# Altium project KitKTS.PrjPcb (part 3 of 3)

## Sheet 18-Led7.SchDoc
size A4
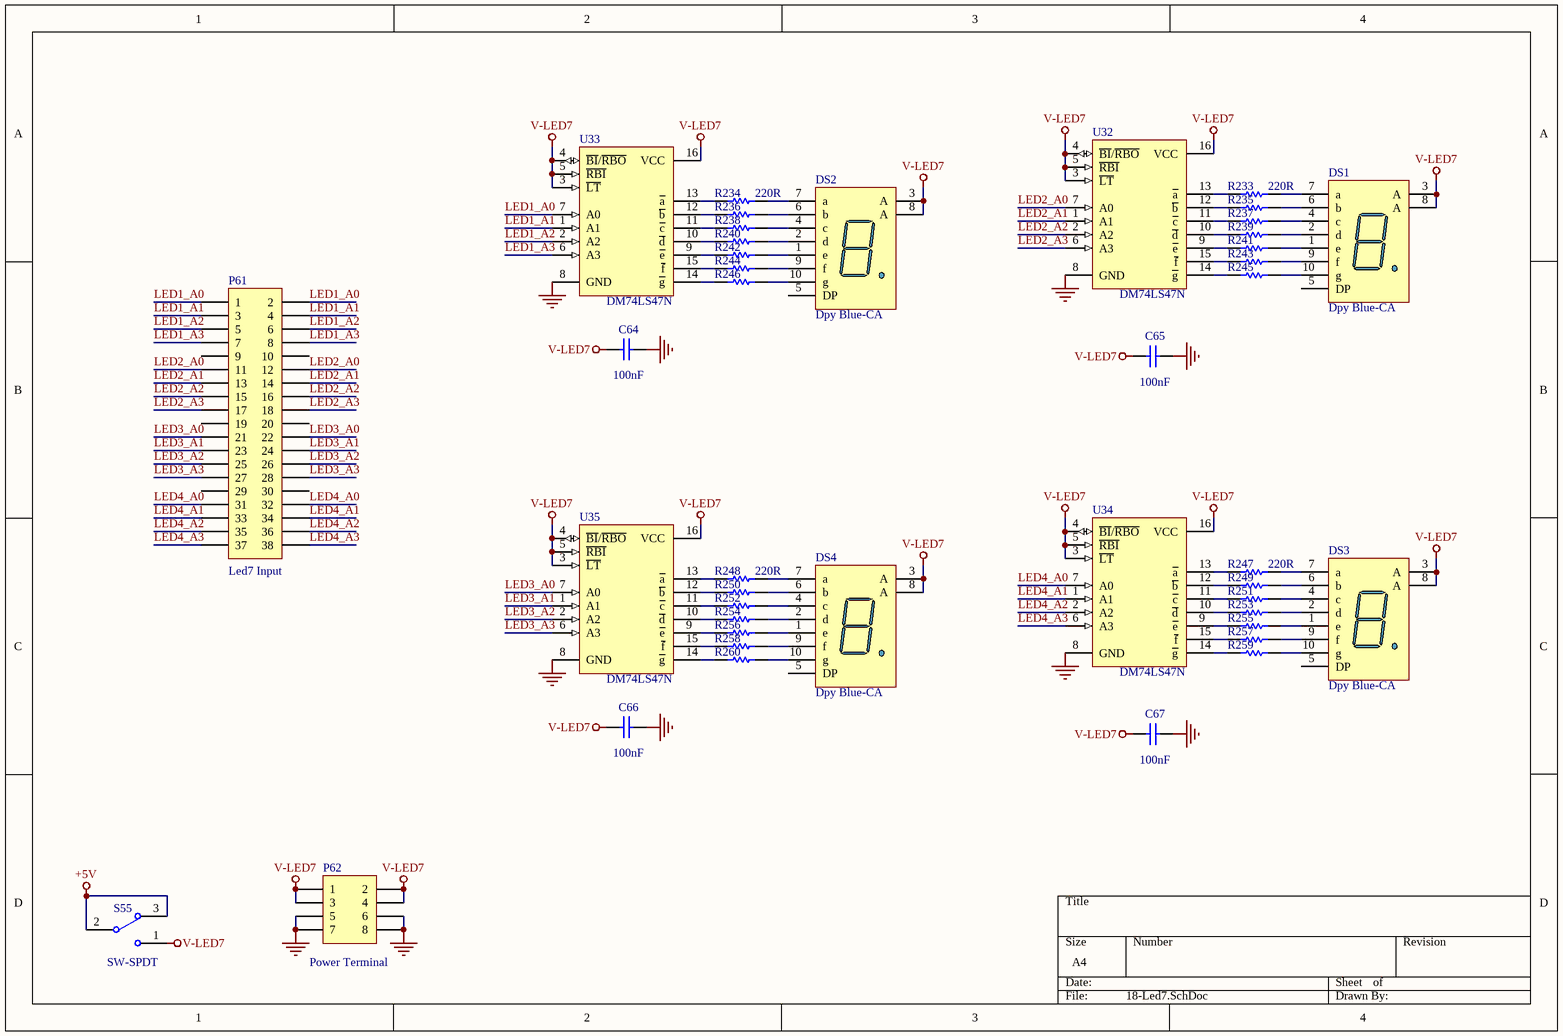
[diagram p25: 18-Led7.SchDoc]

### Parts
C64  value 100nF  [c-0805]  (hidden comment: 104)
C65  value 100nF  [c-0805]  (hidden comment: 104)
C66  value 100nF  [c-0805]  (hidden comment: 104)
C67  value 100nF  [c-0805]  (hidden comment: 104)
DS1  Dpy Blue-CA  [LED7SEG-1-0.56]
DS2  Dpy Blue-CA  [LED7SEG-1-0.56]
DS3  Dpy Blue-CA  [LED7SEG-1-0.56]
DS4  Dpy Blue-CA  [LED7SEG-1-0.56]
P61  value Led7 Input  [HDR2X19]  (hidden comment: Header 19X2)
P62  Publisher: Power Terminal  [HDR2X4]  (hidden comment: Header 4X2)
R233  220R  [r-0805]
R234  220R  [r-0805]
R235  220R  [r-0805]  (value not drawn)
R236  220R  [r-0805]  (value not drawn)
R237  220R  [r-0805]  (value not drawn)
R238  220R  [r-0805]  (value not drawn)
R239  220R  [r-0805]  (value not drawn)
R240  220R  [r-0805]  (value not drawn)
R241  220R  [r-0805]  (value not drawn)
R242  220R  [r-0805]  (value not drawn)
R243  220R  [r-0805]  (value not drawn)
R244  220R  [r-0805]  (value not drawn)
R245  220R  [r-0805]  (value not drawn)
R246  220R  [r-0805]  (value not drawn)
R247  220R  [r-0805]
R248  220R  [r-0805]
R249  220R  [r-0805]  (value not drawn)
R250  220R  [r-0805]  (value not drawn)
R251  220R  [r-0805]  (value not drawn)
R252  220R  [r-0805]  (value not drawn)
R253  220R  [r-0805]  (value not drawn)
R254  220R  [r-0805]  (value not drawn)
R255  220R  [r-0805]  (value not drawn)
R256  220R  [r-0805]  (value not drawn)
R257  220R  [r-0805]  (value not drawn)
R258  220R  [r-0805]  (value not drawn)
R259  220R  [r-0805]  (value not drawn)
R260  220R  [r-0805]  (value not drawn)
S55  SW-SPDT  [sW-DIP1SMD]
U32  DM74LS47N  [DIP16/W0.3]
U33  DM74LS47N  [DIP16/W0.3]
U34  DM74LS47N  [DIP16/W0.3]
U35  DM74LS47N  [DIP16/W0.3]

### Nets
+5V: S55.2 S55.3
GND: C64.2 C65.2 C66.2 C67.2 P62.5 P62.6 P62.7 P62.8 U32.8(GND) U33.8(GND) U34.8(GND) U35.8(GND)
V-LED7: C64.1 C65.1 C66.1 C67.1 DS1.3(A) DS1.8(A) DS2.3(A) DS2.8(A) DS3.3(A) DS3.8(A) DS4.3(A) DS4.8(A) P62.1 P62.2 P62.3 P62.4 S55.1 U32.3(~{LT}) U32.4(~{BI}/~{RBO}) U32.5(~{RBI}) U32.16(VCC) U33.3(~{LT}) U33.4(~{BI}/~{RBO}) U33.5(~{RBI}) U33.16(VCC) U34.3(~{LT}) U34.4(~{BI}/~{RBO}) U34.5(~{RBI}) U34.16(VCC) U35.3(~{LT}) U35.4(~{BI}/~{RBO}) U35.5(~{RBI}) U35.16(VCC)
LED1_A0: P61.1 P61.2 U33.7(A0)
LED1_A1: P61.3 P61.4 U33.1(A1)
LED1_A2: P61.5 P61.6 U33.2(A2)
LED1_A3: P61.7 P61.8 U33.6(A3)
LED2_A0: P61.11 P61.12 U32.7(A0)
LED2_A1: P61.13 P61.14 U32.1(A1)
LED2_A2: P61.15 P61.16 U32.2(A2)
LED2_A3: P61.17 P61.18 U32.6(A3)
LED3_A0: P61.21 P61.22 U35.7(A0)
LED3_A1: P61.23 P61.24 U35.1(A1)
LED3_A2: P61.25 P61.26 U35.2(A2)
LED3_A3: P61.27 P61.28 U35.6(A3)
LED4_A0: P61.31 P61.32 U34.7(A0)
LED4_A1: P61.33 P61.34 U34.1(A1)
LED4_A2: P61.35 P61.36 U34.2(A2)
LED4_A3: P61.37 P61.38 U34.6(A3)
NetDS1_1: DS1.1(e) R241.2
NetDS1_2: DS1.2(d) R239.2
NetDS1_4: DS1.4(c) R237.2
NetDS1_6: DS1.6(b) R235.2
NetDS1_7: DS1.7(a) R233.2
NetDS1_9: DS1.9(f) R243.2
NetDS1_10: DS1.10(g) R245.2
NetDS2_1: DS2.1(e) R242.2
NetDS2_2: DS2.2(d) R240.2
NetDS2_4: DS2.4(c) R238.2
NetDS2_6: DS2.6(b) R236.2
NetDS2_7: DS2.7(a) R234.2
NetDS2_9: DS2.9(f) R244.2
NetDS2_10: DS2.10(g) R246.2
NetDS3_1: DS3.1(e) R255.2
NetDS3_2: DS3.2(d) R253.2
NetDS3_4: DS3.4(c) R251.2
NetDS3_6: DS3.6(b) R249.2
NetDS3_7: DS3.7(a) R247.2
NetDS3_9: DS3.9(f) R257.2
NetDS3_10: DS3.10(g) R259.2
NetDS4_1: DS4.1(e) R256.2
NetDS4_2: DS4.2(d) R254.2
NetDS4_4: DS4.4(c) R252.2
NetDS4_6: DS4.6(b) R250.2
NetDS4_7: DS4.7(a) R248.2
NetDS4_9: DS4.9(f) R258.2
NetDS4_10: DS4.10(g) R260.2
NetR233_1: R233.1 U32.13(~{a})
NetR234_1: R234.1 U33.13(~{a})
NetR235_1: R235.1 U32.12(~{b})
NetR236_1: R236.1 U33.12(~{b})
NetR237_1: R237.1 U32.11(~{c})
NetR238_1: R238.1 U33.11(~{c})
NetR239_1: R239.1 U32.10(~{d})
NetR240_1: R240.1 U33.10(~{d})
NetR241_1: R241.1 U32.9(~{e})
NetR242_1: R242.1 U33.9(~{e})
NetR243_1: R243.1 U32.15(~{f})
NetR244_1: R244.1 U33.15(~{f})
NetR245_1: R245.1 U32.14(~{g})
NetR246_1: R246.1 U33.14(~{g})
NetR247_1: R247.1 U34.13(~{a})
NetR248_1: R248.1 U35.13(~{a})
NetR249_1: R249.1 U34.12(~{b})
NetR250_1: R250.1 U35.12(~{b})
NetR251_1: R251.1 U34.11(~{c})
NetR252_1: R252.1 U35.11(~{c})
NetR253_1: R253.1 U34.10(~{d})
NetR254_1: R254.1 U35.10(~{d})
NetR255_1: R255.1 U34.9(~{e})
NetR256_1: R256.1 U35.9(~{e})
NetR257_1: R257.1 U34.15(~{f})
NetR258_1: R258.1 U35.15(~{f})
NetR259_1: R259.1 U34.14(~{g})
NetR260_1: R260.1 U35.14(~{g})

Not connected (* = marked no-connect by the designer): DS1 5(DP); DS2 5(DP); DS3 5(DP); DS4 5(DP); P61 9 10 19 20 29 30

### Library data of the parts
C64-C67 = Cap: Capacitor; Published: 8-Jun-2000; LatestRevisionDate: 17-Jul-2002; LatestRevisionNote: Re-released for DXP Platform.; PackageReference: RAD-0.3; Publisher: Altium Limited; PackageDescription: Radial Cap, Thru-Hole; 2 Leads; 0.3 in Pin Spacing
DS1-DS4 = Dpy Blue-CA: 14.2 mm General Purpose Blue 7-Segment Display: CA, RH DP, Gray Surface; MinimumIntensity: 2020 ucd; Note: IF = 10 mA; Published: 8-Jun-2000; LatestRevisionDate: 17-Dec-2003; LatestRevisionNote: Schematic revised, PCB Footprint replaced.; DatasheetVersion: 24-Sep-2002; PackageVersion: 24-Sep-2002; PackageReference: H; Publisher: Altium Limited; PackageDescription: LED, 7-Segment Display, 14.2 mm, RHD; 10 Leads; Row Space 15.24 mm; Pitch 2.54 mm; Colour: Blue; ComponentLink1Description: Manufacturer Link; ComponentLink1URL: http://www.agilent.com/
P61 = Header 19X2: Header, 19-Pin, Dual row; LatestRevisionDate: 17-Jul-2002; LatestRevisionNote: Re-released for DXP Platform.
P62 = Header 4X2: Header, 4-Pin, Dual row; LatestRevisionDate: 17-Jul-2002; LatestRevisionNote: Re-released for DXP Platform.
R233-R260 = Res1: Resistor; Published: 8-Jun-2000; LatestRevisionDate: 17-Jul-2002; LatestRevisionNote: Re-released for DXP Platform.; PackageReference: AXIAL-0.3; Publisher: Altium Limited; PackageDescription: Axial Device, Thru-Hole; 2 Leads; 0.3 in Pin Spacing; Value: 220R
S55 = SW-SPDT: SPDT Subminiature Toggle Switch, Right Angle Mounting, Vertical Actuation; Published: 24-Mar-1999; LatestRevisionDate: 17-Dec-2003; LatestRevisionNote: Schematic revised, PCB Footprint replaced.; DatasheetVersion: 05-Dec-2000; PackageReference: TL36WW15050; Publisher: Altium Limited; PackageDescription: Switch; 4 Leads; ComponentLink1Description: Manufacturer Link; ComponentLink1URL: http://www.apem.com
U32-U35 = DM74LS47N: BCD to 7-Segment Decoder/Driver with Open-Collector Output; Published: 17-Jul-2002; LatestRevisionDate: 04-Mar-2005; LatestRevisionNote: Stylized 3D Model Added.; DatasheetVersion: Mar-1998; PackageVersion: 2000; PackageReference: N16E; Publisher: Altium Limited; PackageDescription: DIP, 16-Pin, Row Spacing 7.62 mm, Pitch 2.54 mm; ComponentLink1Description: Manufacturer Link; ComponentLink1URL: http://www.fairchildsemi.com/

## Sheet 19-CPLD.SchDoc
size A4
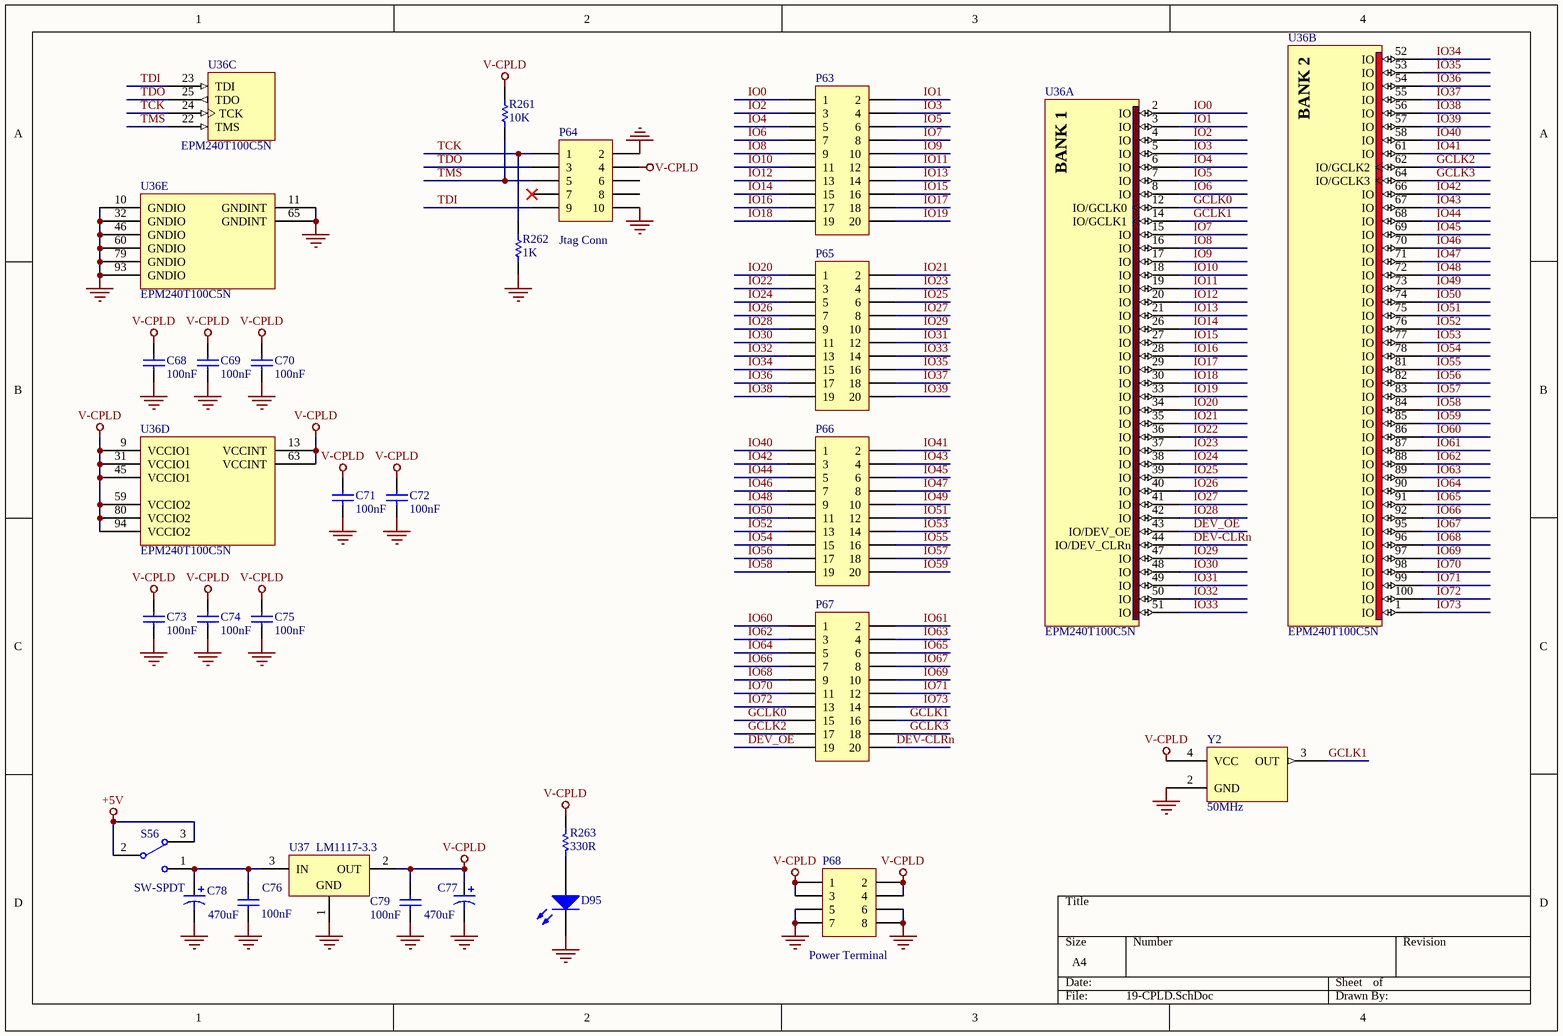
[diagram p26: 19-CPLD.SchDoc]

### Parts
C68  value 100nF  [c-0805]  (hidden comment: 104)
C69  value 100nF  [c-0805]  (hidden comment: 104)
C70  value 100nF  [c-0805]  (hidden comment: 104)
C71  value 100nF  [c-0805]  (hidden comment: 104)
C72  value 100nF  [c-0805]  (hidden comment: 104)
C73  value 100nF  [c-0805]  (hidden comment: 104)
C74  value 100nF  [c-0805]  (hidden comment: 104)
C75  value 100nF  [c-0805]  (hidden comment: 104)
C76  value 100nF  [c-0805]  (hidden comment: 104)
C77  value 470uF  [C-ALU-10x10mm]  (hidden comment: 470uF/16V)
C78  value 470uF  [C-ALU-10x10mm]  (hidden comment: 470uF/16V)
C79  value 100nF  [c-0805]  (hidden comment: 104)
D95  LED  [LED-3528]  (value not drawn)
P63  H2  [HDR2X10]  (value not drawn)
P64  value Jtag Conn  [HDR2X5]  (hidden comment: IDE5x2)
P65  H2  [HDR2X10]  (value not drawn)
P66  H2  [HDR2X10]  (value not drawn)
P67  H2  [HDR2X10]  (value not drawn)
P68  Publisher: Power Terminal  [HDR2X4]  (hidden comment: Header 4X2)
R261  10K  [r-0805]
R262  1K  [r-0805]
R263  value 330R  [r-0805]  (hidden comment: 331)
S56  SW-SPDT  [SW-DIP1SMD]
U36  EPM240T100C5N  [TQFP100L]  (parts A,B,C,D,E of 5)
U37  LM1117-3.3  [sot223]
Y2  50MHz  [xt5032]

### Nets
+5V: S56.2 S56.3
GND: C68.2 C69.2 C70.2 C71.2 C72.2 C73.2 C74.2 C75.2 C76.1 C77.2 C78.2 C79.1 D95.2(K) P64.2 P64.10 P68.5 P68.6 P68.7 P68.8 R262.2 U36.10(GNDIO) U36.11(GNDINT) U36.32(GNDIO) U36.46(GNDIO) U36.60(GNDIO) U36.65(GNDINT) U36.79(GNDIO) U36.93(GNDIO) U37.1(GND) Y2.2(GND)
V-CPLD: C68.1 C69.1 C70.1 C71.1 C72.1 C73.1 C74.1 C75.1 C77.1 C79.2 P64.4 P68.1 P68.2 P68.3 P68.4 R261.1 R263.1 U36.9(VCCIO1) U36.13(VCCINT) U36.31(VCCIO1) U36.45(VCCIO1) U36.59(VCCIO2) U36.63(VCCINT) U36.80(VCCIO2) U36.94(VCCIO2) U37.2(OUT) Y2.4(VCC)
DEV-CLRn: P67.20 U36.44(IO/DEV_CLRn)
DEV_OE: P67.19 U36.43(IO/DEV_OE)
GCLK0: P67.15 U36.12(IO/GCLK0)
GCLK1: P67.16 U36.14(IO/GCLK1) Y2.3(OUT)
GCLK2: P67.17 U36.62(IO/GCLK2)
GCLK3: P67.18 U36.64(IO/GCLK3)
IO0: P63.1 U36.2(IO)
IO1: P63.2 U36.3(IO)
IO2: P63.3 U36.4(IO)
IO3: P63.4 U36.5(IO)
IO4: P63.5 U36.6(IO)
IO5: P63.6 U36.7(IO)
IO6: P63.7 U36.8(IO)
IO7: P63.8 U36.15(IO)
IO8: P63.9 U36.16(IO)
IO9: P63.10 U36.17(IO)
IO10: P63.11 U36.18(IO)
IO11: P63.12 U36.19(IO)
IO12: P63.13 U36.20(IO)
IO13: P63.14 U36.21(IO)
IO14: P63.15 U36.26(IO)
IO15: P63.16 U36.27(IO)
IO16: P63.17 U36.28(IO)
IO17: P63.18 U36.29(IO)
IO18: P63.19 U36.30(IO)
IO19: P63.20 U36.33(IO)
IO20: P65.1 U36.34(IO)
IO21: P65.2 U36.35(IO)
IO22: P65.3 U36.36(IO)
IO23: P65.4 U36.37(IO)
IO24: P65.5 U36.38(IO)
IO25: P65.6 U36.39(IO)
IO26: P65.7 U36.40(IO)
IO27: P65.8 U36.41(IO)
IO28: P65.9 U36.42(IO)
IO29: P65.10 U36.47(IO)
IO30: P65.11 U36.48(IO)
IO31: P65.12 U36.49(IO)
IO32: P65.13 U36.50(IO)
IO33: P65.14 U36.51(IO)
IO34: P65.15 U36.52(IO)
IO35: P65.16 U36.53(IO)
IO36: P65.17 U36.54(IO)
IO37: P65.18 U36.55(IO)
IO38: P65.19 U36.56(IO)
IO39: P65.20 U36.57(IO)
IO40: P66.1 U36.58(IO)
IO41: P66.2 U36.61(IO)
IO42: P66.3 U36.66(IO)
IO43: P66.4 U36.67(IO)
IO44: P66.5 U36.68(IO)
IO45: P66.6 U36.69(IO)
IO46: P66.7 U36.70(IO)
IO47: P66.8 U36.71(IO)
IO48: P66.9 U36.72(IO)
IO49: P66.10 U36.73(IO)
IO50: P66.11 U36.74(IO)
IO51: P66.12 U36.75(IO)
IO52: P66.13 U36.76(IO)
IO53: P66.14 U36.77(IO)
IO54: P66.15 U36.78(IO)
IO55: P66.16 U36.81(IO)
IO56: P66.17 U36.82(IO)
IO57: P66.18 U36.83(IO)
IO58: P66.19 U36.84(IO)
IO59: P66.20 U36.85(IO)
IO60: P67.1 U36.86(IO)
IO61: P67.2 U36.87(IO)
IO62: P67.3 U36.88(IO)
IO63: P67.4 U36.89(IO)
IO64: P67.5 U36.90(IO)
IO65: P67.6 U36.91(IO)
IO66: P67.7 U36.92(IO)
IO67: P67.8 U36.95(IO)
IO68: P67.9 U36.96(IO)
IO69: P67.10 U36.97(IO)
IO70: P67.11 U36.98(IO)
IO71: P67.12 U36.99(IO)
IO72: P67.13 U36.100(IO)
IO73: P67.14 U36.1(IO)
TCK: P64.1 R262.1 U36.24(TCK)
TDI: P64.9 U36.23(TDI)
TDO: P64.3 U36.25(TDO)
TMS: P64.5 R261.2 U36.22(TMS)
NetC76_2: C76.2 C78.1 S56.1 U37.3(IN)
NetD95_1: D95.1(A) R263.2

Not connected (* = marked no-connect by the designer): P64 6 7* 8; Y2 1(NC)

### Notes on the sheet
- (in symbol EPM240T100C5N, part A) BANK 1
- (in symbol EPM240T100C5N, part B) BANK 2

### Library data of the parts
C68-C75 = Cap: Capacitor; Published: 8-Jun-2000; LatestRevisionDate: 17-Jul-2002; LatestRevisionNote: Re-released for DXP Platform.; PackageReference: RAD-0.3; Publisher: Altium Limited; PackageDescription: Radial Cap, Thru-Hole; 2 Leads; 0.3 in Pin Spacing
C76 C79 = Cap: as C55-C62 on sheet 16-BitSW; Published: 08/06/2000; Publisher: Altium Hobart Technology Centre; SubClass: Capacitor
C77 C78 = Cap Pol1: Polarized Capacitor (Radial); Published: 8-Jun-2000; LatestRevisionDate: 17-Jul-2002; LatestRevisionNote: Re-released for DXP Platform.; PackageReference: RB7.6-15; Publisher: Altium Limited
D95 = LED0: Typical INFRARED GaAs LED; Published: 8-Jun-2000; LatestRevisionDate: 08-Jul-2005; LatestRevisionNote: Mech Layer 1 removed.; PackageReference: LED-0; Publisher: Altium Limited; Value: LED
P63 P65-P67 = Header 10X2: Header, 10-Pin, Dual row; Value: IO; LatestRevisionDate: 17-Jul-2002; LatestRevisionNote: Re-released for DXP Platform.
P64 = Header 5X2: Header, 5-Pin, Dual row; LatestRevisionDate: 17-Jul-2002; LatestRevisionNote: Re-released for DXP Platform.
P68 = Header 4X2: Header, 4-Pin, Dual row; LatestRevisionDate: 17-Jul-2002; LatestRevisionNote: Re-released for DXP Platform.
R261-R263 = Res1: Resistor; Published: 8-Jun-2000; LatestRevisionDate: 17-Jul-2002; LatestRevisionNote: Re-released for DXP Platform.; PackageReference: AXIAL-0.3; Publisher: Altium Limited
  R261: Value: 10K
  R262: Value: 1K
S56 = SW-SPDT: as S55 on sheet 18-Led7; Published: 24-Mar-1999; LatestRevisionDate: 17-Dec-2003; LatestRevisionNote: Schematic revised, PCB Footprint replaced.; DatasheetVersion: 05-Dec-2000; PackageReference: TL36WW15050; Publisher: Altium Limited; PackageDescription: Switch; 4 Leads; ComponentLink1Description: Manufacturer Link; ComponentLink1URL: http://www.apem.com
U36 = EPM240T100C5N: MAX II 3.3/2.5V CPLD, 80 IOs, 240 Logic Elements, 100-Pin Plastic TQFP, Commercial Temperature, Speed Grade 5, Pb-Free; Note: Each set of VCCIO pins can be connected to 3.3V, 2.5V, 1.8V, or 1.5V.; Note: All VCCINT pins must be connected to either 3.3V or 2.5V (but not a combination of both).; Published: 4-Mar-2005; LatestRevisionDate: 13-Apr-2006; LatestRevisionNote: IPC-7351 Footprint Added.; DatasheetVersion: ver1.8, Jul-2006; PackageVersion: ver15.1, May-2008; PackageReference: TQFP100; Publisher: Altium Limited; PackageDescription: 100-Pin Plastic Thin Quad Flat Pack (TQFP100) - Wire Bond; Supplier 1: Digi-Key; Supplier Part Number 1: 544-1964-ND; Supplier 2: Farnell; Supplier Part Number 2: 1662268; Supplier 3: Farnell; Supplier Part Number 3: 1453503; Code_JEDEC: MS-026-AED; ComponentLink1Description: Manufacturer Link; ComponentLink1URL: http://www.altera.com/products/devices/cpld/max2/mx2-index.jsp; ComponentLink2Description: Handbook; ComponentLink2URL: http://www.altera.com/literature/hb/max2/max2_mii5v1.pdf; ComponentLink3Description: Packaging Specification; ComponentLink3URL: http://www.altera.com/literature/ds/dspkg.pdf
U37 = LM1117IDTX-3.3: 800mA Low-Dropout Linear Regulator, 3-pin TO-252; Manufacturer: National Semiconductor; PackageTopMarking: NSUZXYTT*LM1117*IDT-3.3; PowerWise: N; CompType: LDO IC; Published: 1-Mar-2010; DatasheetVersion: Apr-2006; PackageVersion: revD, Feb-2009; PackageReference: TD03B; Publisher: Altium Limited; PackageDescription: TO252, Molded, Jedec, 6.8 x 6.10 x 2.30mm Body, 3 Lead, 2.28mm Pitch, Surface Mount; PartNumber: LM1117IDTX-3.3; Value: LM1117-3.3; PinCount: 3; Code_JEDEC: TO-252-AA; ComponentLink1Description: LM1117 Datasheet; ComponentLink1URL: http://www.national.com/ds/LM/LM1117.pdf; ComponentLink2Description: LM1117 Web Page; ComponentLink2URL: http://www.national.com/pf/LM/LM1117.html; ComponentLink3Description: TD03B Package Page; ComponentLink3URL: http://www.national.com/packaging/folders/td03b.html
Y2 = OSC: XTAL 50MHz, 4pin; Value: 50MHz

## Nets that join several sheets
+3V3: 01-Breadboard (6 pins), 02-PowerSupply (19 pins), 16-BitSW (S53.2 S53.3)
+5V: 01-Breadboard (6 pins), 02-PowerSupply (22 pins), 03-PulseGenerator (S16.2 S16.3), 04-LogicAND (S17.2 S17.3), 05-LogicOR (S18.2 S18.3), 06-LogicNOT (S9.2 S9.3), 07-LogicXOR (S1.2 S1.3), 08-LogicNAND (S19.2 S19.3), 09-LogicNOR (S20.2 S20.3), 10-Buffer (S21.2 S21.3), 11-DFlipFlop (S6.2 S6.3), 12-JKFlipFlop (S8.2 S8.3), 13-Counter74LS90 (S7.2 S7.3), 14-Counter74LS192 (S35.2 S35.3), 15-DistanceSRF05 (S36.2 S36.3), 17-Led (S54.2 S54.3), 18-Led7 (S55.2 S55.3), 19-CPLD (S56.2 S56.3)
+12V: 01-Breadboard (6 pins), 02-PowerSupply (20 pins)
-5V: 01-Breadboard (6 pins), 02-PowerSupply (20 pins)
-12V: 01-Breadboard (6 pins), 02-PowerSupply (20 pins)
GND: 01-Breadboard (12 pins), 02-PowerSupply (46 pins), 03-PulseGenerator (39 pins), 04-LogicAND (6 pins), 04-ANDStatusLed (12 pins), 05-LogicOR (6 pins), 05-ORStatusLed (12 pins), 06-LogicNOT (6 pins), 06-NOTStatusLed (12 pins), 07-LogicXOR (6 pins), 07-XORStatusLed (12 pins), 08-LogicNAND (6 pins), 08-NANDStatusLed (12 pins), 09-LogicNOR (6 pins), 09-NORStatusLed (12 pins), 10-Buffer (8 pins), 11-DFlipFlop (16 pins), 12-JKFlipFlop (8 pins), 13-Counter74LS90 (20 pins), 14-Counter74LS192 (36 pins), 15-DistanceSRF05 (9 pins), 16-BitSW (28 pins), 16-BitSWStatusLed (8 pins), 17-Led (C63.2 P60.19 P60.20 U31.9), 18-Led7 (12 pins), 19-CPLD (30 pins)
V-AND: 03-PulseGenerator (P36.1 P36.2 P36.3 P36.4), 04-LogicAND (6 pins), 04-ANDStatusLed (12 pins)
V-NAND: 08-LogicNAND (6 pins), 08-NANDStatusLed (12 pins)
V-NOR: 09-LogicNOR (6 pins), 09-NORStatusLed (12 pins)
V-NOT: 06-LogicNOT (6 pins), 06-NOTStatusLed (12 pins)
V-OR: 05-LogicOR (6 pins), 05-ORStatusLed (12 pins)
V-SW: 16-BitSW (21 pins), 16-BitSWStatusLed (8 pins)
V-XOR: 07-LogicXOR (6 pins), 07-XORStatusLed (12 pins)
VCC: 05-LogicOR (U21.14), 06-LogicNOT (U10.14), 08-LogicNAND (U22.14), 09-LogicNOR (U23.14), 12-JKFlipFlop (U8.4 U9.4)
VDD: 04-LogicAND (U20.14), 07-LogicXOR (U1.14), 11-DFlipFlop (U2.14 U3.14)
ANDI1: 04-LogicAND (P37.1 P37.2 U20.1), 04-ANDStatusLed (R36.2)
ANDI2: 04-LogicAND (P37.3 P37.4 U20.2), 04-ANDStatusLed (R37.2)
ANDI3: 04-LogicAND (P37.7 P37.8 U20.4), 04-ANDStatusLed (R38.2)
ANDI4: 04-LogicAND (P37.9 P37.10 U20.5), 04-ANDStatusLed (R39.2)
ANDI5: 04-LogicAND (P37.13 P37.14 U20.9), 04-ANDStatusLed (R44.2)
ANDI6: 04-LogicAND (P37.15 P37.16 U20.10), 04-ANDStatusLed (R45.2)
ANDI7: 04-LogicAND (P37.19 P37.20 U20.12), 04-ANDStatusLed (R46.2)
ANDI8: 04-LogicAND (P37.21 P37.22 U20.13), 04-ANDStatusLed (R47.2)
ANDO1: 04-LogicAND (P38.1 P38.2 U20.3), 04-ANDStatusLed (R52.2)
ANDO2: 04-LogicAND (P38.5 P38.6 U20.6), 04-ANDStatusLed (R53.2)
ANDO3: 04-LogicAND (P38.9 P38.10 U20.8), 04-ANDStatusLed (R54.2)
ANDO4: 04-LogicAND (P38.13 P38.14 U20.11), 04-ANDStatusLed (R55.2)
BIT0: 16-BitSW (P57.1 P57.2 S37.2), 16-BitSWStatusLed (R213.2)
BIT1: 16-BitSW (P57.3 P57.4 S39.2), 16-BitSWStatusLed (R214.2)
BIT2: 16-BitSW (P57.5 P57.6 S41.2), 16-BitSWStatusLed (R215.2)
BIT3: 16-BitSW (P57.7 P57.8 S43.2), 16-BitSWStatusLed (R216.2)
BIT4: 16-BitSW (P57.9 P57.10 S45.2), 16-BitSWStatusLed (R221.2)
BIT5: 16-BitSW (P57.11 P57.12 S46.2), 16-BitSWStatusLed (R222.2)
BIT6: 16-BitSW (P57.13 P57.14 S48.2), 16-BitSWStatusLed (R223.2)
BIT7: 16-BitSW (P57.15 P57.16 S50.2), 16-BitSWStatusLed (R224.2)
NANDI1: 08-LogicNAND (P43.1 P43.2 U22.1), 08-NANDStatusLed (R132.2)
NANDI2: 08-LogicNAND (P43.3 P43.4 U22.2), 08-NANDStatusLed (R133.2)
NANDI3: 08-LogicNAND (P43.7 P43.8 U22.4), 08-NANDStatusLed (R134.2)
NANDI4: 08-LogicNAND (P43.9 P43.10 U22.5), 08-NANDStatusLed (R135.2)
NANDI5: 08-LogicNAND (P43.13 P43.14 U22.9), 08-NANDStatusLed (R140.2)
NANDI6: 08-LogicNAND (P43.15 P43.16 U22.10), 08-NANDStatusLed (R141.2)
NANDI7: 08-LogicNAND (P43.19 P43.20 U22.12), 08-NANDStatusLed (R142.2)
NANDI8: 08-LogicNAND (P43.21 P43.22 U22.13), 08-NANDStatusLed (R143.2)
NANDO1: 08-LogicNAND (P44.1 P44.2 U22.3), 08-NANDStatusLed (R148.2)
NANDO2: 08-LogicNAND (P44.5 P44.6 U22.6), 08-NANDStatusLed (R149.2)
NANDO3: 08-LogicNAND (P44.9 P44.10 U22.8), 08-NANDStatusLed (R150.2)
NANDO4: 08-LogicNAND (P44.13 P44.14 U22.11), 08-NANDStatusLed (R151.2)
NORI1: 09-LogicNOR (P46.1 P46.2 U23.2), 09-NORStatusLed (R156.2)
NORI2: 09-LogicNOR (P46.3 P46.4 U23.3), 09-NORStatusLed (R157.2)
NORI3: 09-LogicNOR (P46.7 P46.8 U23.5), 09-NORStatusLed (R158.2)
NORI4: 09-LogicNOR (P46.9 P46.10 U23.6), 09-NORStatusLed (R159.2)
NORI5: 09-LogicNOR (P46.13 P46.14 U23.8), 09-NORStatusLed (R164.2)
NORI6: 09-LogicNOR (P46.15 P46.16 U23.9), 09-NORStatusLed (R165.2)
NORI7: 09-LogicNOR (P46.19 P46.20 U23.11), 09-NORStatusLed (R166.2)
NORI8: 09-LogicNOR (P46.21 P46.22 U23.12), 09-NORStatusLed (R167.2)
NORO1: 09-LogicNOR (P47.1 P47.2 U23.1), 09-NORStatusLed (R172.2)
NORO2: 09-LogicNOR (P47.5 P47.6 U23.4), 09-NORStatusLed (R173.2)
NORO3: 09-LogicNOR (P47.9 P47.10 U23.10), 09-NORStatusLed (R174.2)
NORO4: 09-LogicNOR (P47.13 P47.14 U23.13), 09-NORStatusLed (R175.2)
NOTI1: 06-LogicNOT (P13.1 P13.2 U10.1), 06-NOTStatusLed (R86.2)
NOTI2: 06-LogicNOT (P13.5 P13.6 U10.3), 06-NOTStatusLed (R87.2)
NOTI3: 06-LogicNOT (P13.9 P13.10 U10.5), 06-NOTStatusLed (R88.2)
NOTI4: 06-LogicNOT (P13.13 P13.14 U10.9), 06-NOTStatusLed (R89.2)
NOTI5: 06-LogicNOT (P13.17 P13.18 U10.11), 06-NOTStatusLed (R90.2)
NOTI6: 06-LogicNOT (P13.21 P13.22 U10.13), 06-NOTStatusLed (R91.2)
NOTO1: 06-LogicNOT (P14.1 P14.2 U10.2), 06-NOTStatusLed (R98.2)
NOTO2: 06-LogicNOT (P14.5 P14.6 U10.4), 06-NOTStatusLed (R99.2)
NOTO3: 06-LogicNOT (P14.9 P14.10 U10.6), 06-NOTStatusLed (R100.2)
NOTO4: 06-LogicNOT (P14.13 P14.14 U10.8), 06-NOTStatusLed (R101.2)
NOTO5: 06-LogicNOT (P14.17 P14.18 U10.10), 06-NOTStatusLed (R102.2)
NOTO6: 06-LogicNOT (P14.21 P14.22 U10.12), 06-NOTStatusLed (R103.2)
ORI1: 05-LogicOR (P40.1 P40.2 U21.1), 05-ORStatusLed (R60.2)
ORI2: 05-LogicOR (P40.3 P40.4 U21.2), 05-ORStatusLed (R61.2)
ORI3: 05-LogicOR (P40.7 P40.8 U21.4), 05-ORStatusLed (R62.2)
ORI4: 05-LogicOR (P40.9 P40.10 U21.5), 05-ORStatusLed (R63.2)
ORI5: 05-LogicOR (P40.13 P40.14 U21.9), 05-ORStatusLed (R68.2)
ORI6: 05-LogicOR (P40.15 P40.16 U21.10), 05-ORStatusLed (R69.2)
ORI7: 05-LogicOR (P40.19 P40.20 U21.12), 05-ORStatusLed (R70.2)
ORI8: 05-LogicOR (P40.21 P40.22 U21.13), 05-ORStatusLed (R71.2)
ORO1: 05-LogicOR (P41.1 P41.2 U21.3), 05-ORStatusLed (R76.2)
ORO2: 05-LogicOR (P41.5 P41.6 U21.6), 05-ORStatusLed (R77.2)
ORO3: 05-LogicOR (P41.9 P41.10 U21.8), 05-ORStatusLed (R78.2)
ORO4: 05-LogicOR (P41.13 P41.14 U21.11), 05-ORStatusLed (R79.2)
XORI1: 07-LogicXOR (P1.1 P1.2 U1.1), 07-XORStatusLed (R108.2)
XORI2: 07-LogicXOR (P1.3 P1.4 U1.2), 07-XORStatusLed (R109.2)
XORI3: 07-LogicXOR (P1.7 P1.8 U1.5), 07-XORStatusLed (R110.2)
XORI4: 07-LogicXOR (P1.9 P1.10 U1.6), 07-XORStatusLed (R111.2)
XORI5: 07-LogicXOR (P1.13 P1.14 U1.8), 07-XORStatusLed (R116.2)
XORI6: 07-LogicXOR (P1.15 P1.16 U1.9), 07-XORStatusLed (R117.2)
XORI7: 07-LogicXOR (P1.19 P1.20 U1.12), 07-XORStatusLed (R118.2)
XORI8: 07-LogicXOR (P1.21 P1.22 U1.13), 07-XORStatusLed (R119.2)
XORO1: 07-LogicXOR (P2.1 P2.2 U1.3), 07-XORStatusLed (R124.2)
XORO2: 07-LogicXOR (P2.5 P2.6 U1.4), 07-XORStatusLed (R125.2)
XORO3: 07-LogicXOR (P2.9 P2.10 U1.10), 07-XORStatusLed (R126.2)
XORO4: 07-LogicXOR (P2.13 P2.14 U1.11), 07-XORStatusLed (R127.2)